# EasyEDA Pro project 麦克风.epro

# Schematic Schematic1
Board Name: Board1; Create Date: 2024-11-12; Page Name: P1; Project Name: microphone_lichaoyuan_202306010309_V1.0; Schematic Name: Schematic1; Update Date: 2024-11-12; Company: 嘉立创EDA; Page Size: A4; Version: V1.0
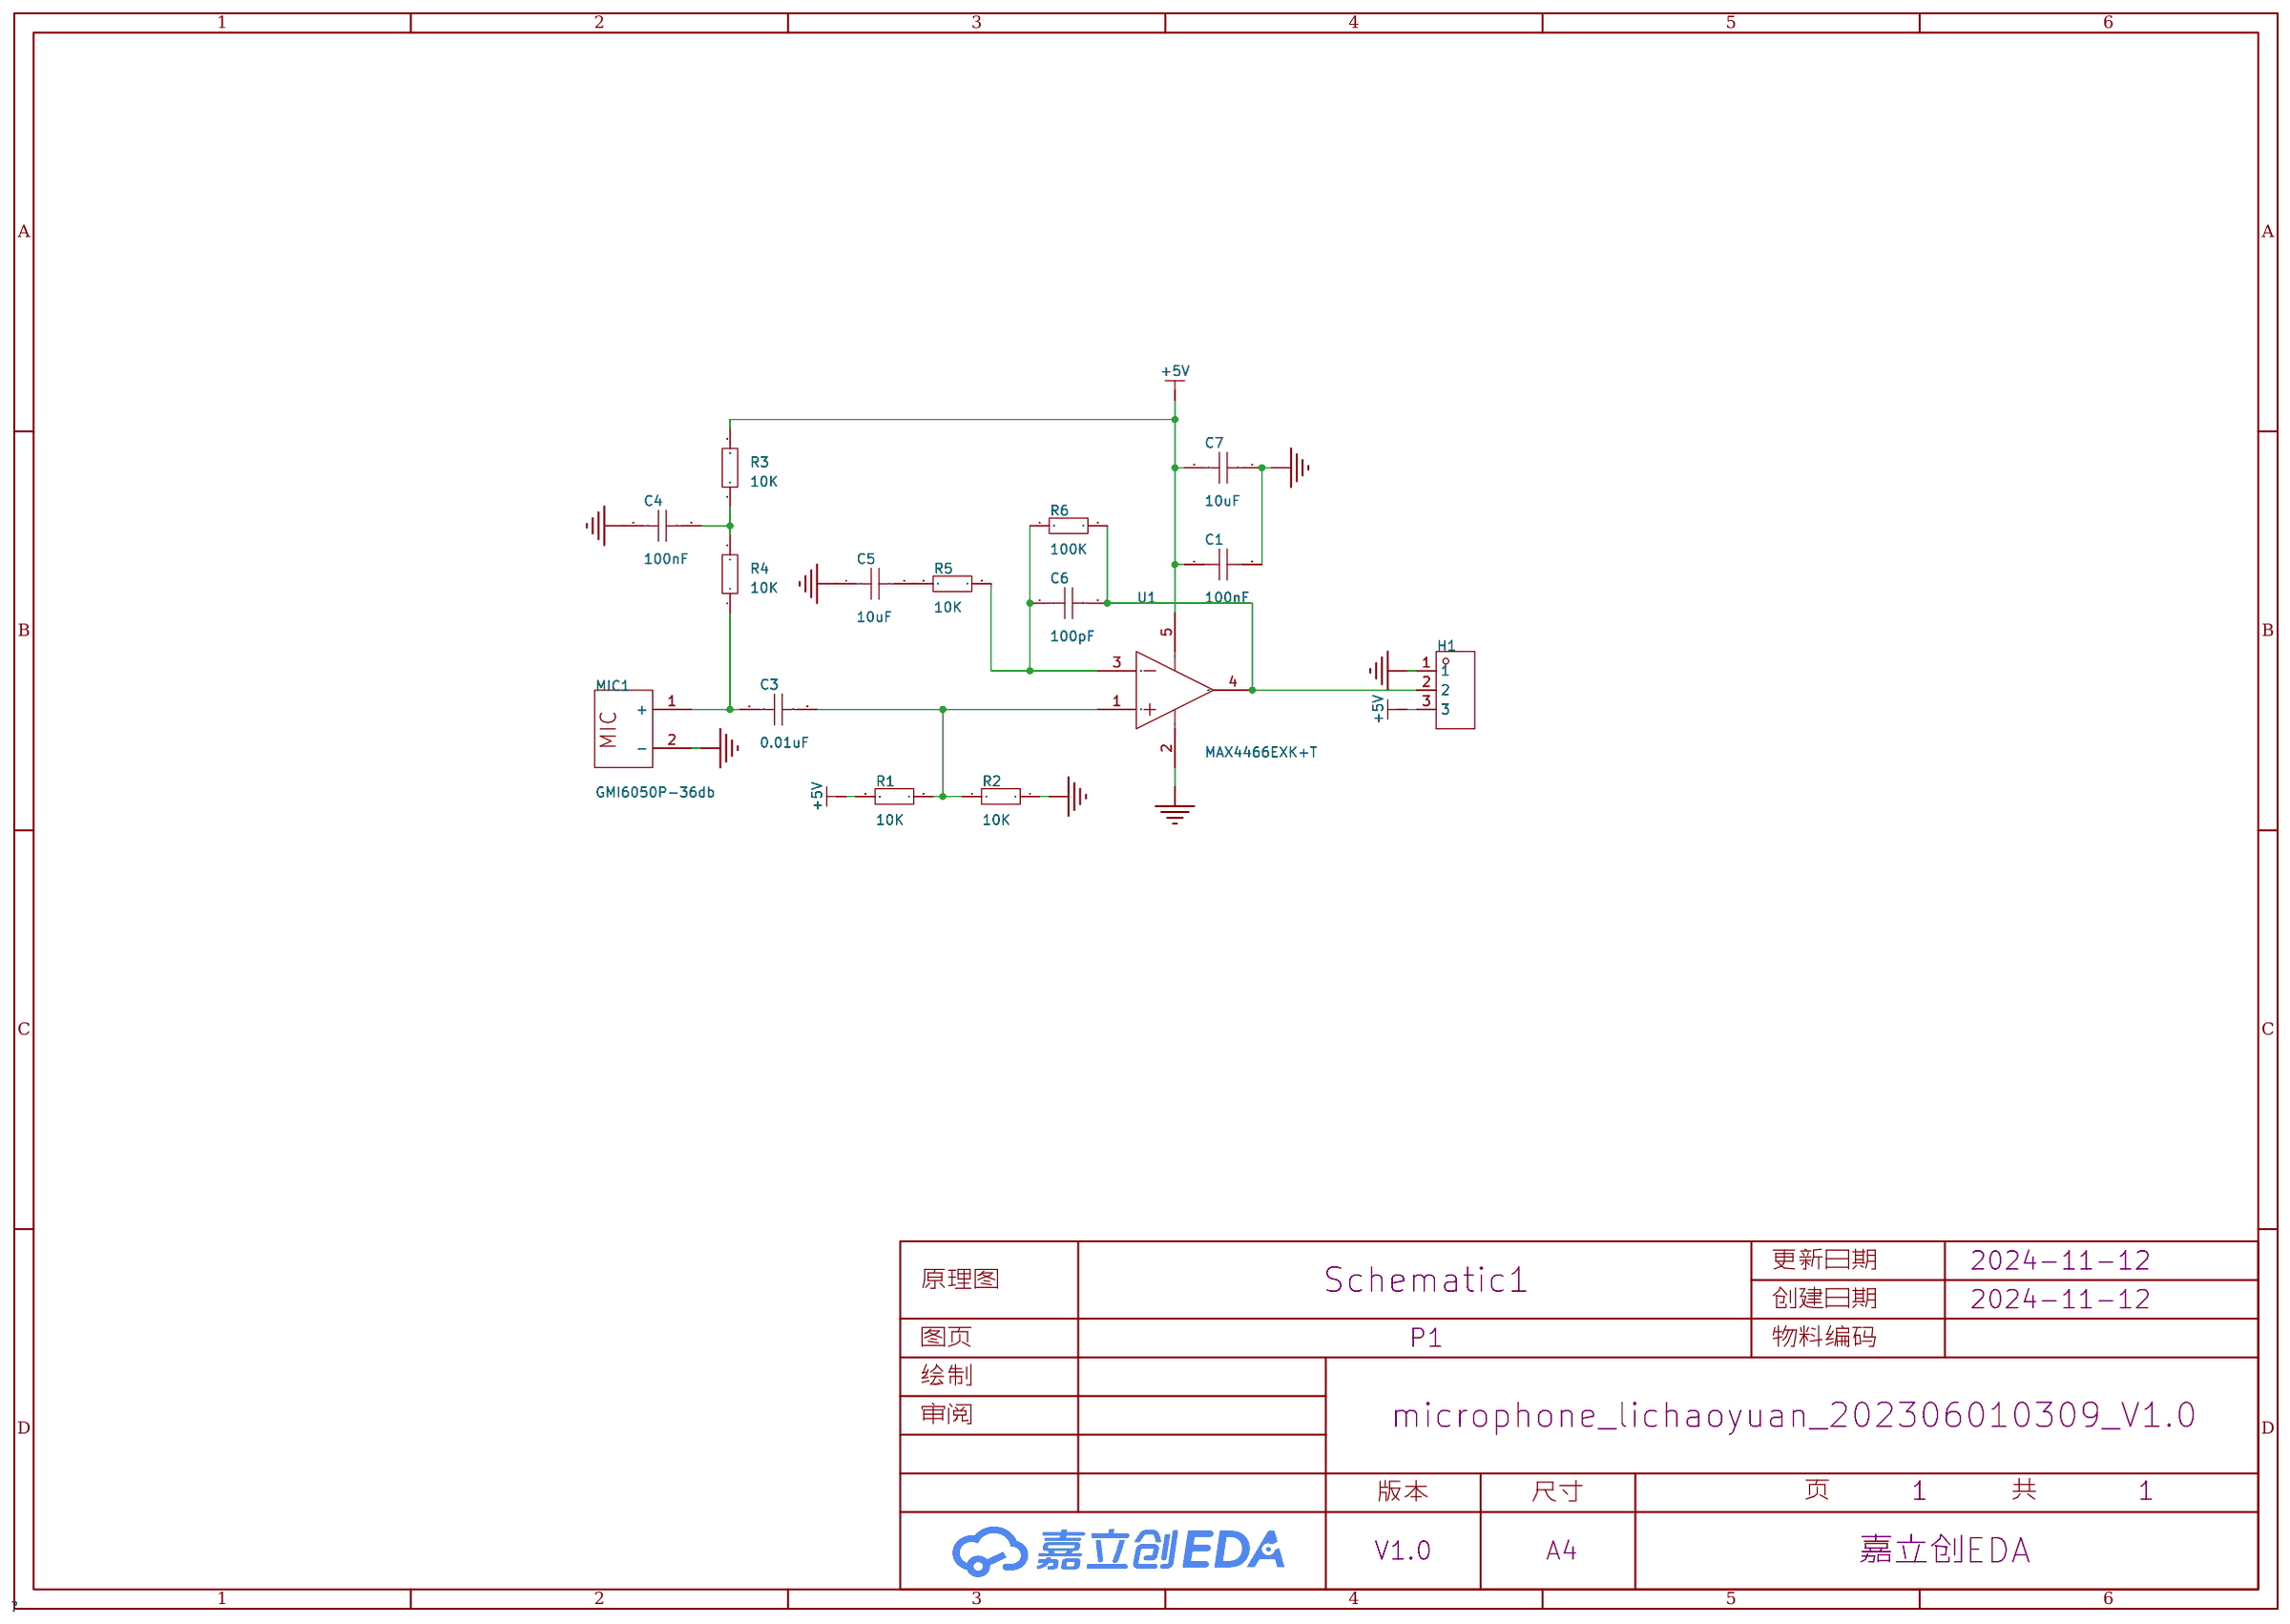
[diagram p0: schematic sheet]

## Parts
C1  100nF  [C0603]
C3  0.01uF  [C0603]
C4  100nF  [C0603]
C5  10uF  [C0603]
C6  100pF  [C0603]
C7  10uF  [C0603]
H1  -  [HDR-TH_3P-P2.54-V-F]
MIC1  GMI6050P-36db  [MIC-TH_BD6.0-P1.90-D0.4-L-FD_GMI6050P-2CXXDB]
R1  10K  [R0603]
R2  10K  [R0603]
R3  10K  [R0603]
R4  10K  [R0603]
R5  10K  [R0603]
R6  100K  [R0603]
U1  MAX4466EXK+T  [SC-70-5_L2.0-W1.3-P0.65-LS2.1-BR]

## Library data of the parts
C1 C3-C7 = CAP_0603: Supplier Footprint: 0603
H1 = HDR-F_2.54_1x3P: Supplier Part: C541850; Supplier Footprint: 插件
MIC1 = GMI6050P-36db: LCSC Part Name: 全指向φ6.0*5.0mm 1.5V-10V 灵敏度-36db 低阻抗 针脚; Supplier Part: C233939; Manufacturer: INGHAi(赢海); Supplier Footprint: 插件,D=6mm; JLCPCB Part Class: 扩展库; Datasheet: https://atta.szlcsc.com/upload/public/pdf/source/20180613/C233951_CF3F103FE3546E5F8FCD1BC0597FF08F.pdf; Supplier: LCSC
R1-R6 = Res_0603: Supplier Footprint: 0603
U1 = MAX4466EXK+T: 功放类型:-;扬声器通道数:单声道;输出功率:-;静态电流(Iq):-;; LCSC Part Name: 低成本、微功耗、SC70/SOT23-8封装、麦克风前置放大器，可完全关断; Supplier Part: C7456762; Manufacturer: ADI(亚德诺)/MAXIM(美信); Supplier Footprint: SC-70-5; JLCPCB Part Class: 扩展库; Datasheet: https://atta.szlcsc.com/upload/public/pdf/source/20230919/1C26F795883D5A758FE0EDB1A75C39BE.pdf; Supplier: LCSC; Speaker Channels: 单声道; Supply Voltage: 2.4V~5.5V; Operating Temperature: -40℃~+85℃

## Nets
+5V: C1.1 C7.2 H1.3 R1.2 R3.2 U1.5(VCC)
GND: C1.2 C4.1 C5.1 C7.1 H1.1 MIC1.2(-) R2.1 U1.2(GND)
$1N609: C3.2 R1.1 R2.2 U1.1(IN+)
$1N661: C3.1 MIC1.1(+) R4.1
$1N669: C4.2 R3.1 R4.2
$1N766: C6.1 R5.2 R6.1 U1.3(IN-)
$1N821: C5.2 R5.1
$1N965: C6.2 H1.2 R6.2 U1.4(OUT)

# Board PCB1
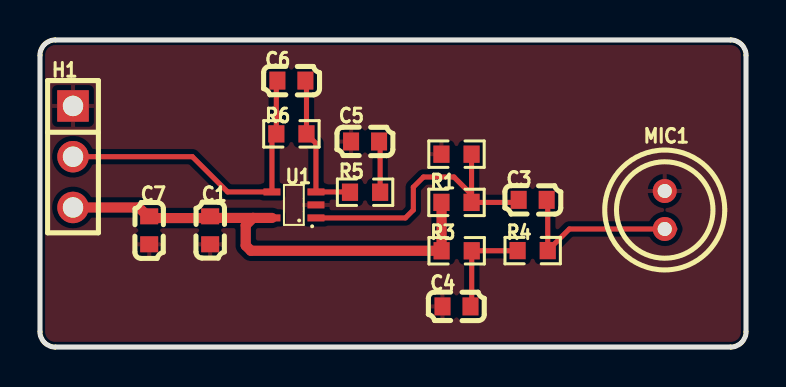
[diagram p1: board, top side]
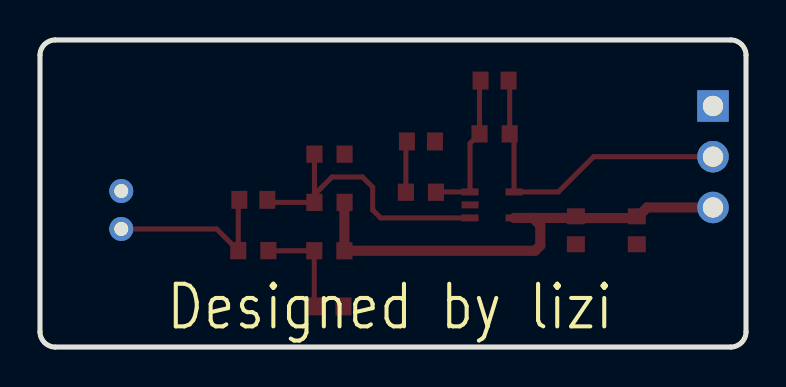
[diagram p2: board, bottom side, seen from below]

Outline 35.31 x 15.37 mm; copper layers: Top Layer, Bottom Layer. Coordinates in mm from the lower left corner of the outline.
Outline path: 0,14.61 0,0.76 arc(0.22,0.22) 0.76,0 34.54,0 arc(35.08,0.22) 35.31,0.76 35.31,14.61 arc(35.08,15.14) 34.54,15.37 0.76,15.37 arc(0.22,15.14) 0,14.61
Stack: Top Layer 0.035mm / Dielectric1 1.51mm FR4 er 4.5 / Bottom Layer 0.035mm

## Design rules (mm)
template: 自定义配置
spacing copperThickness1oz (default): track to track 0.102, other pairs 0.152 to 0.3
spacing copperThickness2oz: track to track 0.203, other pairs 0.152 to 0.3
track width copperThickness1oz (default): min 0.127, default 0.254, max 2.54
track width copperThickness2oz: min 0.203, default 0.254, max 2.54
differential pair differentialPair (default): width min 0.127, default 0.254, max 2.54; gap min 0.152, default 0.152
via viaSize (default): diameter min 0.5, default 0.61, max 10; hole min 0.3, default 0.305, max 6.3

## Placement (name value [footprint] x y rotation side)
C1  100nF  [C0603]  8.51 5.84 270 top
C3  0.01uF  [C0603]  24.64 7.37 180 top
C4  100nF  [C0603]  20.83 2.03 0 top
C5  10uF  [C0603]  16.26 10.29 0 top
C6  100pF  [C0603]  12.57 13.33 180 top
C7  10uF  [C0603]  5.46 5.84 90 top
H1  -  [HDR-TH_3P-P2.54-V-F]  1.65 9.53 270 top
MIC1  GMI6050P-36db  [MIC-TH_BD6.0-P1.90-D0.4-L-FD_GMI6050P-2CXXDB]  31.24 6.86 90 top
R1  10K  [R0603]  20.83 7.24 180 top
R2  10K  [R0603]  20.83 9.65 0 top
R3  10K  [R0603]  20.84 4.82 180 top
R4  10K  [R0603]  24.64 4.83 180 top
R5  10K  [R0603]  16.26 7.75 180 top
R6  100K  [R0603]  12.57 10.67 180 top
U1  MAX4466EXK+T  [SC-70-5_L2.0-W1.3-P0.65-LS2.1-BR]  12.7 7.11 0 top

## Footprints (pads in the part's own frame, mm; a bottom-side part is the same pattern mirrored in y, then rotated)
C0603
  rect 0.8x0.9 smd: 1(-0.7,0) 2(0.7,0)
HDR-TH_3P-P2.54-V-F
  rect 1.575x1.575 hole 1.02: 1(-2.54,0)
  round 1.575 hole 1.02: 2(0,0) 3(2.54,0)
MIC-TH_BD6.0-P1.90-D0.4-L-FD_GMI6050P-2CXXDB
  round 1.2 hole 0.7: 1(-0.95,0) 2(0.95,0)
R0603
  rect 0.806x0.864 smd: 1(-0.753,0) 2(0.753,0)
SC-70-5_L2.0-W1.3-P0.65-LS2.1-BR
  rect 0.85x0.35 smd: 1(1.1,-0.65) 2(1.1,0) 3(1.1,0.65) 4(-1.1,0.65) 5(-1.1,-0.65)

## Nets
As in the schematic.

## Routing (per net, layer and track width the routed paths; a pad name or vN(x,y) marks a point on that pad's centre or on a via; arc(x,y) is an arc through that point)
+5V: length 24.1
  Top Layer w0.508: R1.2 20.08,7.23 R3.2 10.55,4.82 10.29,5.08 10.29,6.1 10.65,6.46 ; H1.3 4.94,6.98 5.48,6.45 8.42,6.45 C1.1 8.59,6.46 10.65,6.46 ; 10.65,6.46 U1.5
$1N609: length 14.4
  Top Layer w0.254: 21.58,7.76 21.45,7.76 20.7,8.51 19.18,8.51 18.67,8 18.67,6.86 18.27,6.46 U1.1 ; 21.58,7.76 R1.1 23.81,7.24 C3.2 ; 21.58,7.76 R2.2
$1N661: length 9.4
  Top Layer w0.254: 25.34,7.37 25.39,7.31 R4.1 26.47,5.91 31.75,5.91
$1N669: length 5.1
  Top Layer w0.254: C4.2 21.59,2.09 R3.1 23.88,4.82 R4.2
$1N766: length 7.5
  Top Layer w0.254: C6.1 13.33,13.28 R6.1 13.8,10.19 U1.3 15.49,7.76 R5.2
$1N821: length 2.6
  Top Layer w0.254: R5.1 17.01,10.23 C5.2
$1N965: length 16.4
  Top Layer w0.254: C6.2 11.82,13.28 R6.2 11.6,10.45 U1.4 9.38,7.76 7.62,9.53 H1.2

## Copper pours and planes (outline as drawn; the poured copper is in the pictures)
GND on Top Layer: 0,15.37 35.31,15.37 35.31,0 0,0

## Text on the board
Bottom Silkscreen Layer: Designed by lizi
